# EAGLE design wroom02Breakout4x4 (EAGLE 7.3.0)
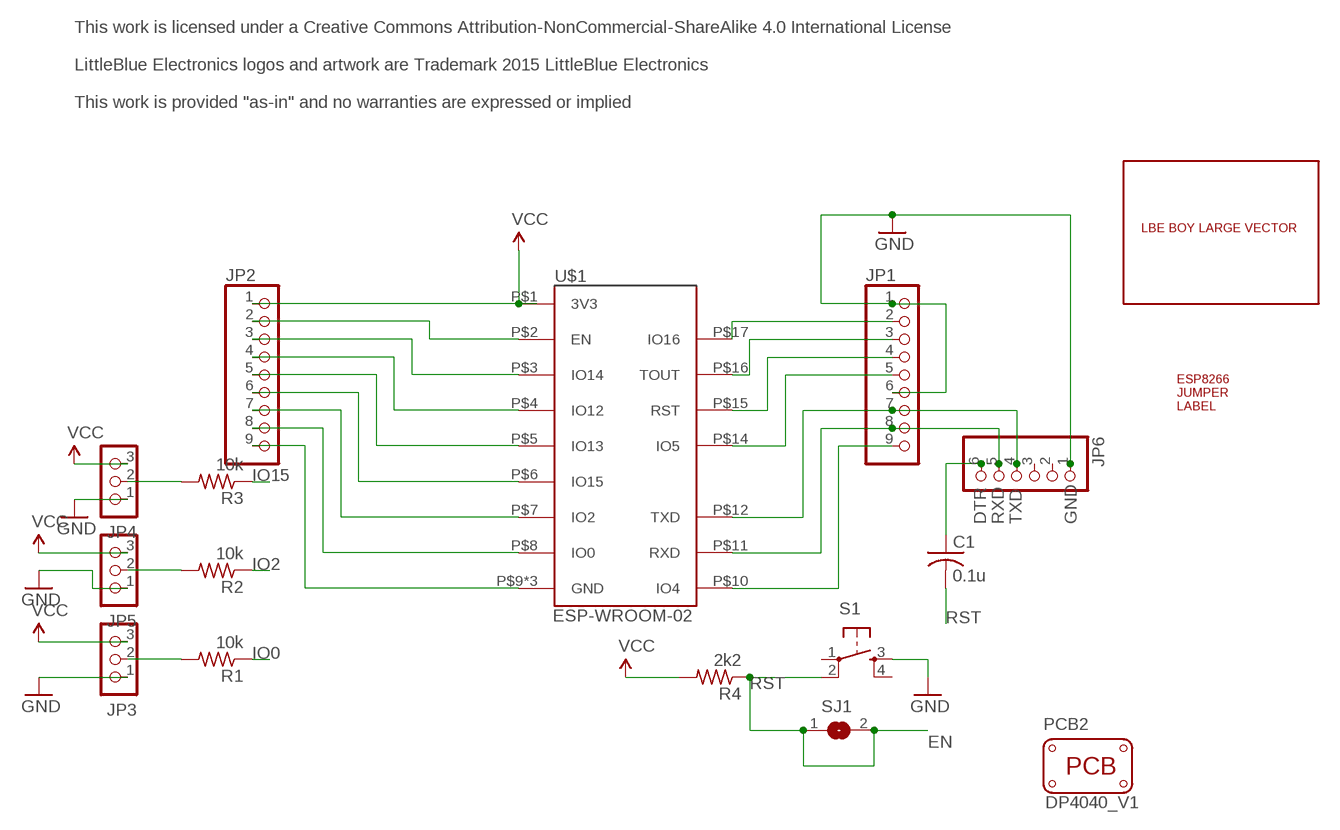
[diagram p0: schematic, sheet 1]

## Parts
C1  0.1u  C-USC0603  [C0603]
JP1  PINHD-1X9  [1X09]
JP2  PINHD-1X9  [1X09]
JP3  CON_HEADER_1X03-PTH  [M1X3]
JP4  CON_HEADER_1X03-PTH  [M1X3]
JP5  CON_HEADER_1X03-PTH  [M1X3]
JP6  PINHD-1X6/90  [1X06/90]
PCB2  PCB_DP_SQUARE-4X4  [DP4040_V1]
R1  10k  R-US_R0603  [R0603]
R2  10k  R-US_R0603  [R0603]
R3  10k  R-US_R0603  [R0603]
R4  2k2  R-US_R0603  [R0603]
S1  TAC_SWITCHSMD  [TACTILE_SWITCH_SMD]
SJ1  SJ  [SJ]
U$1  ESP-WROOM-02  [ESP-WROOM-02]
U$4  LBE-BOY-LARGE-VECTOR  [LBE_BOY_LARGE_VECTOR]
U$5  ESP8266_JUMPER_LABEL  [ESP8266_JUMPER_LABEL]

## Nets
DTR: C1.1 JP6.6
EN: JP2.2 SJ1.2 U$1.P$2(EN)
GND: JP1.1 JP1.6 JP2.9 JP3.1 JP4.1 JP5.1 JP6.1 S1.3 U$1.P$9(GND) U$1.P$13(GND) U$1.P$18(GND)
IO0: JP2.8 R1.1 U$1.P$8(IO0)
IO2: JP2.7 R2.1 U$1.P$7(IO2)
IO4: JP1.9 U$1.P$10(IO4)
IO5: JP1.5 U$1.P$14(IO5)
IO12: JP2.4 U$1.P$4(IO12)
IO13: JP2.5 U$1.P$5(IO13)
IO14: JP2.3 U$1.P$3(IO14)
IO15: JP2.6 R3.1 U$1.P$6(IO15)
IO16: JP1.2 U$1.P$17(IO16)
N$6: JP3.2 R1.2
N$8: JP5.2 R2.2
N$17: JP4.2 R3.2
RST: C1.2 JP1.4 R4.1 S1.2 SJ1.1 U$1.P$15(RST)
RXD: JP1.8 JP6.5 U$1.P$11(RXD)
TOUT: JP1.3 U$1.P$16(TOUT)
TXD: JP1.7 JP6.4 U$1.P$12(TXD)
VCC: JP2.1 JP3.3 JP4.3 JP5.3 R4.2 U$1.P$1(3V3)
Unconnected: JP6.2 JP6.3 S1.1 S1.4

## Notes on the sheet
- This work is licensed under a Creative Commons Attribution-NonCommercial-ShareAlike 4.0 International License 
  
  LittleBlue Electronics logos and artwork are Trademark 2015 LittleBlue Electronics
  
  This work is provided "as-in" and no warranties are expressed or implied

## Library data of the parts
C1 = rcl:C-US: CAPACITOR, American symbol
JP1 JP2 = pinhead:PINHD-1X9: PIN HEADER
JP3-JP5 = dp_devices:CON_HEADER_1X03
JP6 = pinhead:PINHD-1X6: PIN HEADER
PCB2 = dp_devices:PCB_DP_SQUARE: Dangerous Prototypes Standard Square PCB sizes; PCB_SIZE: DP4040_V1
R1-R4 = resistor:R-US_: RESISTOR, American symbol
S1 = SparkFun-Electromechanical:TAC_SWITCH: Momentary Switch Button commonly used for reset or general input. Spark Fun Electronics SKU : COM-00097 SMT- SWCH-08247; PROD_ID: SWCH-08247
SJ1 = jumper:SJ: SMD solder JUMPER
U$1 = esp8266:ESP-WROOM-02
U$4 = esp8266:LBE-BOY-LARGE-VECTOR
U$5 = esp8266:ESP8266_JUMPER_LABEL

## Board
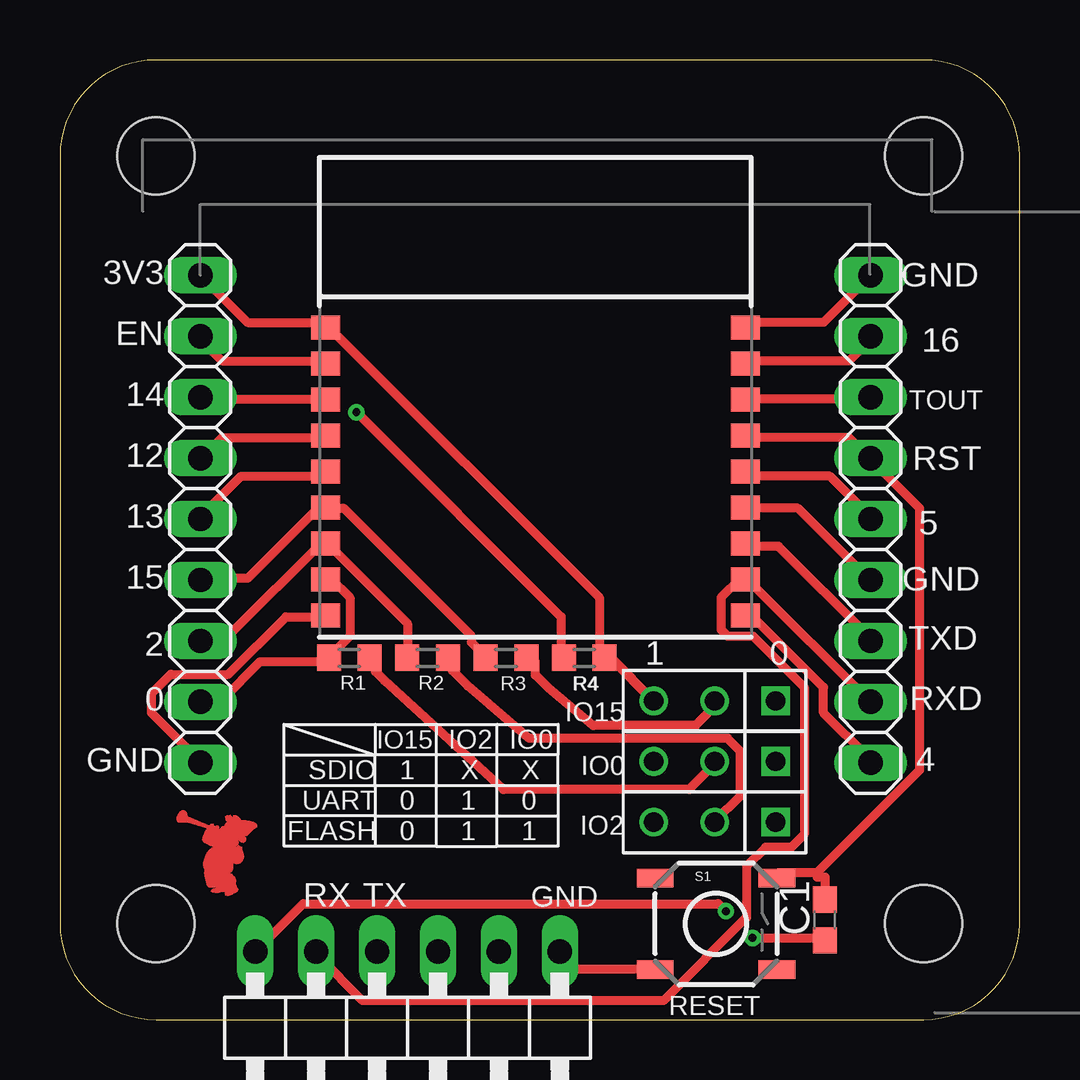
[diagram p1: board, top side]
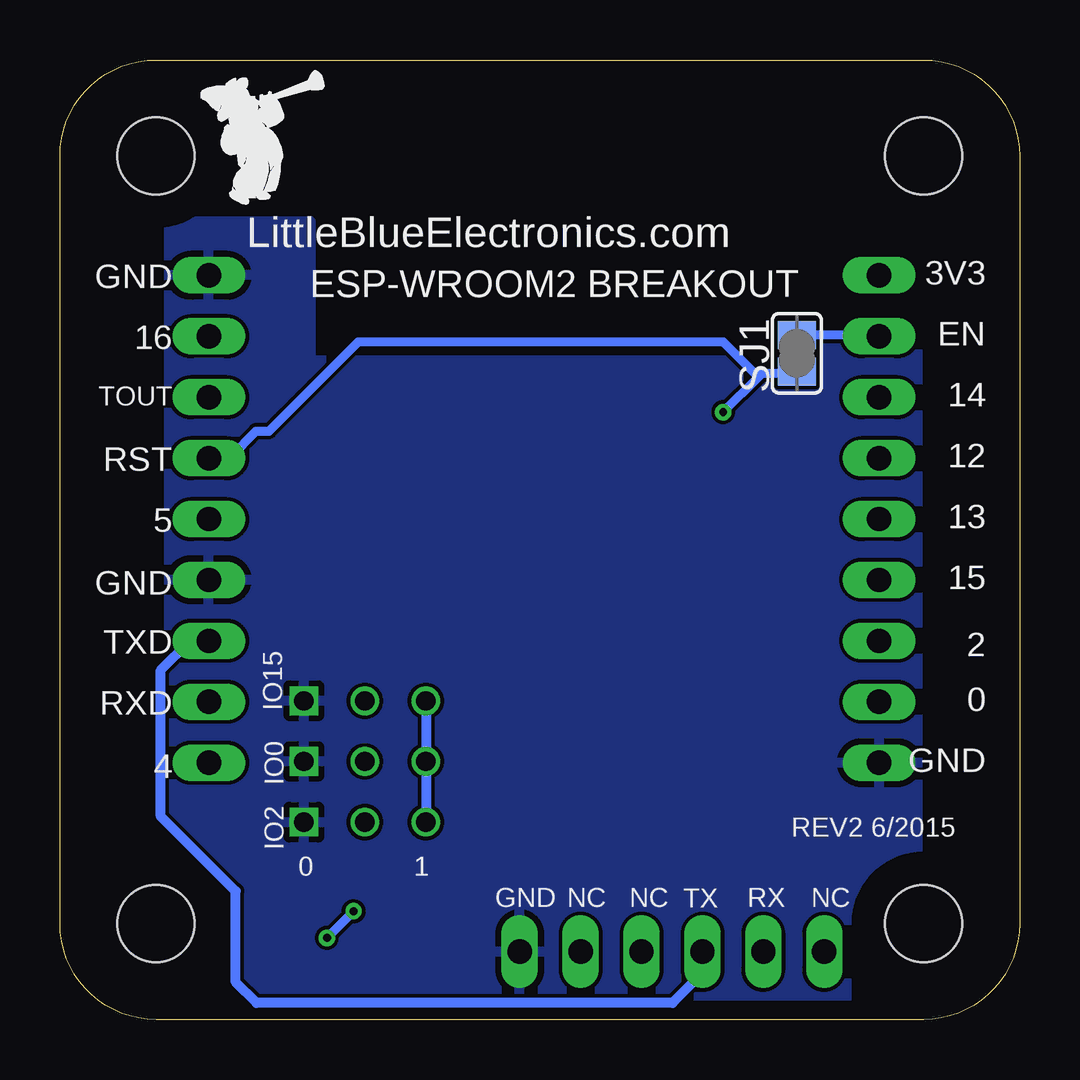
[diagram p2: board, bottom side, seen from below]

Size 40 x 40 mm. Coordinates in mm from the lower left corner, seen from the top.
Copper layers (1*16): Top 0.0356mm / dielectric 1.5011mm / Bottom 0.0356mm
Design rules "LaenPCBOrder *": minimum track width 15mil, minimum drill 13mil, track to track 6mil, track to pad 6mil, pad to pad 6mil, via to via 6mil, smd to smd 6mil, copper to edge 15mil, drill to drill 6mil, minimum pad ring 7mil, minimum via ring 7mil, stop-mask expansion 3mil, vias tented up to drill 100mil, thermal gap 10mil

### Footprints (pad centres in the part's own frame; a part is rotated, then mirrored left to right if it is on the bottom)
C0603 = smd 1.1 x 1: 1 -0.85,0; 2 0.85,0
1X09 = drill 1.016 long: 1 -10.16,0; 2 -7.62,0; 3 -5.08,0; 4 -2.54,0; 5 0,0; 6 2.54,0; 7 5.08,0; 8 7.62,0; 9 10.16,0
M1X3 = drill 0.8 square: 1 0,0 | drill 0.8: 2 2.54,0; 3 5.08,0
1X06/90 = drill 1.016 long: 1 -6.35,-3.81; 2 -3.81,-3.81; 3 -1.27,-3.81; 4 1.27,-3.81; 5 3.81,-3.81; 6 6.35,-3.81
DP4040_V1 = hole 3.2: -16,-16; 16,-16; 16,16; -16,16
R0603 = smd 1 x 1.1: 1 -0.85,0; 2 0.85,0
TACTILE_SWITCH_SMD = smd 1.524 x 0.762: 1 -2.54,1.905; 2 2.54,1.905; 3 -2.54,-1.905; 4 2.54,-1.905
SJ = smd 1.168 x 1.6: 1 -0.762,0; 2 0.762,0
ESP-WROOM-02 = smd 1.2 x 0.99: P$1 -8.75,2.9; P$2 -8.75,1.4; P$3 -8.75,-0.1; P$4 -8.75,-1.6; P$5 -8.75,-3.1; P$6 -8.75,-4.6; P$7 -8.75,-6.1; P$8 -8.75,-7.6; P$9 -8.75,-9.1; P$10 8.75,-9.1; P$11 8.75,-7.6; P$12 8.75,-6.1; P$13 8.75,-4.6; P$14 8.75,-3.1; P$15 8.75,-1.6; P$16 8.75,-0.1; P$17 8.75,1.4; P$18 8.75,2.9

### Placement (x,y rotation side)
C1  31.89,4.15 90 top
JP1  33.79,20.86 270 top
JP2  5.85,20.86 270 top
JP3  29.83,10.76 180 top
JP4  29.83,13.29 180 top
JP5  29.83,8.23 180 top
JP6  14.49,-0.98 180 top
PCB2  20,20 0 top
R1  12.06,15.08 0 top
R2  15.33,15.08 0 top
R3  18.59,15.08 0 top
R4  21.85,15.08 0 top
S1  27.35,3.99 0 top
SJ1  9.28,27.77 90 bottom
U$1  19.82,25.94 0 top
U$2  LBE-BOY-SM-VECTOR  [LBE_BOY_SMALL_VECTOR]  6.53,6.94 0 top
U$4  31.88,36.47 0 top
U$5  15.17,9.76 0 top

### Tracks (layer width: path | path; a pad name or v marks a point on that pad's centre or on a via)
DTR  (via drill 0.33)
  Top 0.381: v28.87,3.4 31.89,3.4 C1.1 | v27.76,4.51 27.44,4.83 10.14,4.83 JP6.6
  Bottom 0.381: v27.76,4.51 v28.87,3.4
EN
  Top 0.381: U$1.P$2 11.02,27.45 6.75,27.45 5.95,28.25 JP2.2
  Bottom 0.381: SJ1.2 9.15,28.52 5.95,28.52 JP2.2
GND
  Top 0.381: U$1.P$9 11.02,16.79 9.42,16.79 7.02,14.39 4.62,14.39 3.82,13.59 3.82,12.79 5.69,10.92 JP2.9 | U$1.P$13 28.62,21.32 30.76,21.32 33.69,18.39 JP1.6 | JP1.1 31.82,29.06 28.62,29.06 U$1.P$18 | S1.3 24.62,2.12 21.42,2.12 20.89,2.65 JP6.1
  Top 0.406: U$1.P$18 28.56,28.84 28.56,28.86
  Bottom 0.381: JP1.1 33.96,31.19 33.84,31.19
  pour Bottom: 10.15,27.68 10.15,33.38 4.25,33.38 4.25,0.98 35.45,0.98 35.45,33.28 29.55,33.28 29.55,27.48 9.95,27.48
IO0
  Top 0.381: U$1.P$8 11.29,18.39 12.09,17.59 12.09,15.99 11.29,15.19 R1.1 11.02,14.92 8.35,14.92 6.75,13.32 5.95,13.32 JP2.8
IO2
  Top 0.381: R2.1 14.49,15.19 14.49,16.52 11.29,19.72 U$1.P$7 11.02,19.99 7.02,15.99 5.95,15.99 JP2.7
IO4
  Top 0.381: U$1.P$10 28.62,16.79 28.89,16.79 31.82,13.85 31.82,12.79 33.69,10.92 JP1.9
IO5
  Top 0.381: U$1.P$14 28.62,22.65 32.09,22.65 33.69,21.05 JP1.5
IO12
  Top 0.381: U$1.P$4 11.02,24.25 6.75,24.25 5.95,23.45 JP2.4
IO13
  Top 0.381: U$1.P$5 11.02,22.65 7.55,22.65 5.95,21.05 JP2.5
IO14
  Top 0.381: U$1.P$3 11.02,25.85 5.95,25.85 JP2.3
IO15
  Top 0.381: 17.69,15.19 17.16,15.72 17.16,15.99 11.82,21.32 11.29,21.32 U$1.P$6 11.02,21.59 7.82,18.39 5.95,18.39 JP2.6
  Top 0.406: 17.69,15.19 R3.1
IO16
  Top 0.381: U$1.P$17 28.62,27.45 32.89,27.45 33.69,28.25 JP1.2
N$1
  Bottom 0.152: 9.26,28.38 9.28,28.41
  Bottom 0.406: 9.26,27.09 9.26,28.38
N$6
  Top 0.381: R1.2 13.16,14.92 13.16,14.5 13.52,14.13 18.49,9.59 26.22,9.59 27.29,10.65 JP3.2
N$8
  Top 0.381: R2.2 16.36,14.92 16.36,14.55 17,13.9 19.56,11.72 27.82,11.72 28.36,11.19 28.36,9.32 27.29,8.25 JP5.2
N$17
  Top 0.381: R3.2 19.82,14.92 19.82,14.36 20.38,13.8 22.22,12.25 26.49,12.25 27.29,13.05 JP4.2
RST  (via drill 0.33)
  Top 0.381: v12.35,25.32 20.89,16.79 20.89,15.19 R4.1 | U$1.P$15 28.62,24.25 32.89,24.25 33.69,23.45 JP1.4 33.96,23.19 35.82,21.32 35.82,10.39 31.56,6.12 | 31.56,6.12 29.96,6.12 S1.2 | C1.2 31.89,5.94 31.57,5.94 31.56,6.12
  Bottom 0.381: 10.89,26.79 10.75,26.92 9.42,26.92 SJ1.1 | 10.89,26.79 v12.35,25.32 | 10.89,26.79 12.35,28.25 27.56,28.25 31.29,24.52 31.82,24.52 32.89,23.45 33.69,23.45 JP1.4
RXD
  Top 0.381: JP1.8 33.69,13.32 28.89,18.12 28.62,18.12 U$1.P$11 28.36,18.39 27.56,17.59 27.56,16.25 27.82,15.99 28.89,15.99 31.02,13.85 31.02,7.72 30.49,7.19 29.42,7.19 28.62,6.39 28.62,4.25 25.16,0.78 12.62,0.78 10.75,2.65 JP6.5
TOUT
  Top 0.381: U$1.P$16 28.62,25.85 33.69,25.85 JP1.3
TXD
  Top 0.381: U$1.P$12 28.62,19.72 29.96,19.72 33.69,15.99 JP1.7
  Bottom 0.406: JP6.4 13.22,1.94 14.46,0.7 31.81,0.7 32.67,1.56 32.67,5.34 35.8,8.47 35.8,14.56 34.58,15.78 JP1.7
VCC
  Top 0.381: JP2.1 7.82,29.06 11.02,29.06 U$1.P$1 11.29,28.79 22.49,17.59 22.49,15.19 R4.2
  Top 0.406: R4.2 22.96,15.08 JP4.3
  Bottom 0.406: JP4.3 JP3.3 JP5.3

### Text on the board
tPlace: 3V3 | GND | EN | 16 | 14 | TOUT | 12 | RST | 13 | 5 | 15 | GND | 2 | TXD | 1 | 0 | RXD | 0 | R1 | R2 | R3 | R4 | IO15 | GND | IO0 | 4 | IO2 | RX | TX | GND | RESET
bPlace: LittleBlueElectronics.com | 3V3 | GND | ESP-WROOM2 BREAKOUT | EN | 16 | 14 | TOUT | 12 | RST | 13 | 5 | 15 | GND | 2 | TXD | IO15 | 0 | RXD | GND | IO0 | 4 | IO2 | REV2 6/2015 | 1 | 0 | NC | RX | TX | NC | NC | GND
Document: This work is licensed under a Creative Commons Attribution-NonCommercial-ShareAlike 4.0 International License / / LittleBlue Electronics logos and artwork are Trademark 2015 LittleBlue Electronics / / This work is provided "as-in" and no warranties are expressed or implied
bDocu: MFR # Here